# Altium schematic sheet Capstone.SchDoc
size A; SheetNumber: 1; SheetTotal: 3; SPICEModelCacheSYHMEIGD: <root> / <DocumentId>SYHMEIGD</DocumentId> / </root>
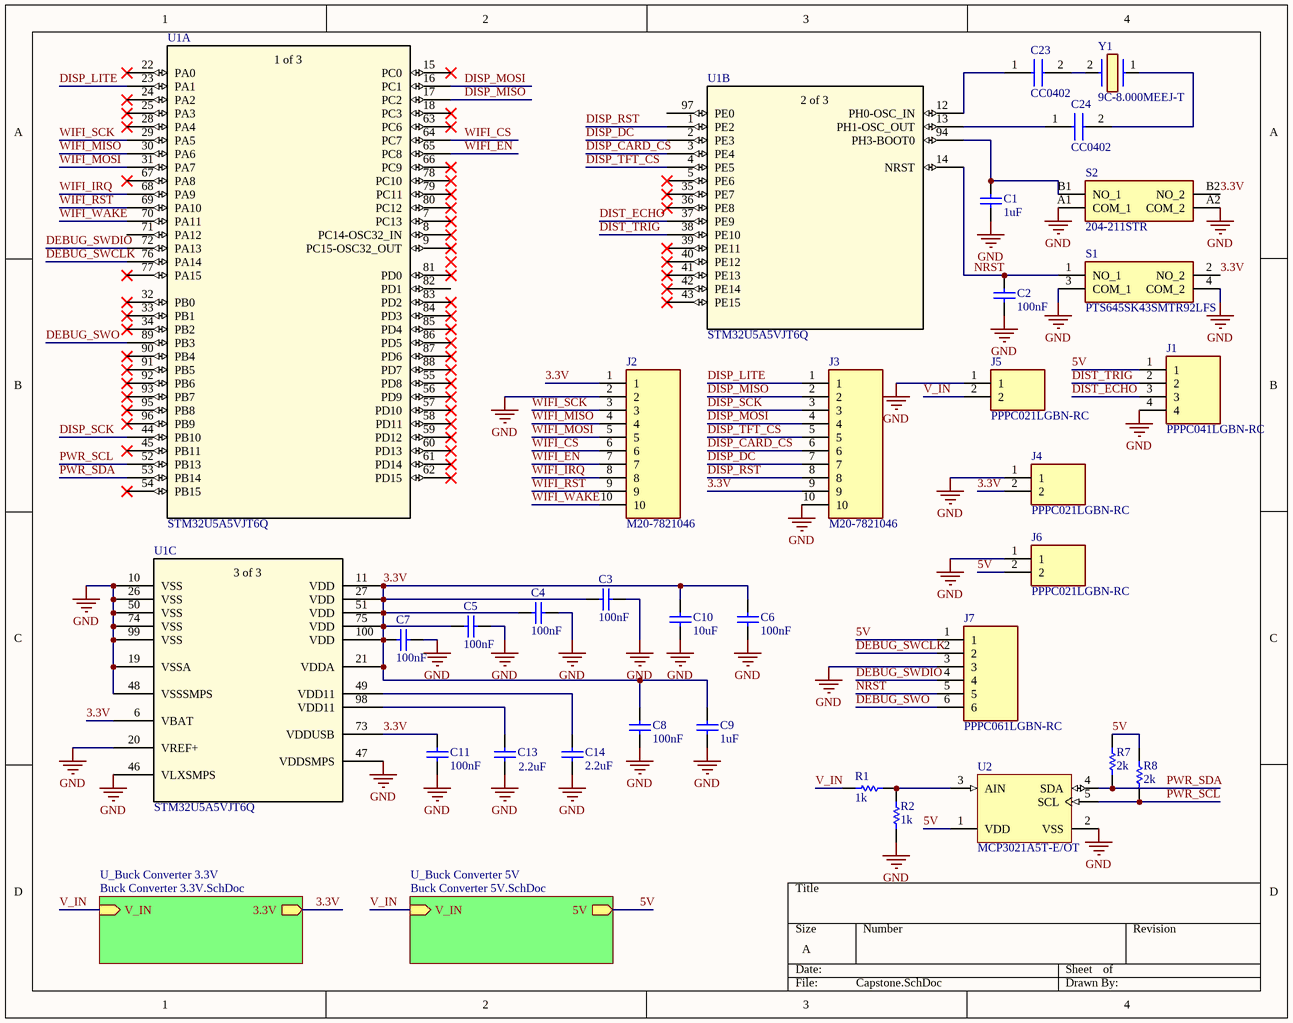
[diagram p0: Capstone.SchDoc]

## Parts
C1  1uF  [CAPC2013X135X45LL10T25]
C2  100nF  [CAPC2013X135X45LL10T25]
C3  100nF  [CAPC2013X135X45LL10T25]
C4  100nF  [CAPC2013X135X45LL10T25]
C5  100nF  [CAPC2013X135X45LL10T25]
C6  100nF  [CAPC2013X135X45LL10T25]
C7  100nF  [CAPC2013X135X45LL10T25]
C8  100nF  [CAPC2013X135X45LL10T25]
C9  1uF  [CAPC2013X135X45LL10T25]
C10  10uF  [CAPC2013X135X45LL10T25]
C11  100nF  [CAPC2013X135X45LL10T25]
C13  2.2uF  [CAPC2013X135X45LL10T25]
C14  2.2uF  [CAPC2013X135X45LL10T25]
C23  CC0402  [CAPC1005X55N]
C24  CC0402  [CAPC1005X55N]
J1  PPPC041LGBN-RC  [RHDRRA4W60P0X254_1X4_1066X850X274P]
J2  M20-7821046  [RHDR10W70P0X254_1X10_2580X250X865P]
J3  M20-7821046  [RHDR10W70P0X254_1X10_2580X250X865P]
J4  PPPC021LGBN-RC  [RHDRRA2W60P0X254_1X2_558X850X274P]
J5  PPPC021LGBN-RC  [RHDRRA2W60P0X254_1X2_558X850X274P]
J6  PPPC021LGBN-RC  [RHDRRA2W60P0X254_1X2_558X850X274P]
J7  PPPC061LGBN-RC  [PPPC061LGBNRC]
R1  1k  [RESC1608X55X25ML10T15]
R2  1k  [RESC1608X55X25ML10T15]
R7  2k  [RESC1608X55X25ML10T15]
R8  2k  [RESC1608X55X25ML10T15]
S1  PTS645SK43SMTR92LFS  [PTS645SK43SMTR92LFS]
S2  204-211STR  [204211STR]
U1  STM32U5A5VJT6Q  [LQFP-100_STM]  (parts A,B,C of 3)
U2  MCP3021A5T-E/OT  [SOT-23-OT5_M]
Y1  9C-8.000MEEJ-T  [9C7680MBBKT]

## Sub-sheets
U_Buck Converter 3.3V = Buck Converter 3.3V.SchDoc: 3.3V (out), V_IN (in)
U_Buck Converter 5V = Buck Converter 5V.SchDoc: 5V (out), V_IN (in)

## Nets
GND: C1.1 C2.1 C3.2 C4.2 C5.2 C6.1 C7.2 C8.1 C9.1 C10.1 C11.1 C13.1 C14.1 J1.4 J2.2 J3.10 J4.1 J5.1 J6.1 J7.3 R2.2 S1.3(COM_1) S1.4(COM_2) S2.A1(COM_1) S2.A2(COM_2) U1.10(VSS) U1.19(VSSA) U1.20(VREF+) U1.26(VSS) U1.46(VLXSMPS) U1.47(VDDSMPS) U1.48(VSSSMPS) U1.50(VSS) U1.74(VSS) U1.99(VSS) U2.2(VSS)
3.3V: C3.1 C4.1 C5.1 C6.2 C7.1 C8.2 C9.2 C10.2 C11.2 J2.1 J3.9 J4.2 S1.2(NO_2) S2.B2(NO_2) U1.6(VBAT) U1.11(VDD) U1.21(VDDA) U1.27(VDD) U1.51(VDD) U1.73(VDDUSB) U1.75(VDD) U1.100(VDD) ; sheet U_Buck Converter 3.3V/3.3V
5V: J1.1 J6.2 J7.1 R7.1 R8.1 U2.1(VDD) ; sheet U_Buck Converter 5V/5V
DEBUG_SWCLK: J7.2 U1.76(PA14)
DEBUG_SWDIO: J7.4 U1.72(PA13)
DEBUG_SWO: J7.6 U1.89(PB3)
DISP_CARD_CS: J3.6 U1.3(PE4)
DISP_DC: J3.7 U1.2(PE3)
DISP_LITE: J3.1 U1.23(PA1)
DISP_MISO: J3.2 U1.17(PC2)
DISP_MOSI: J3.4 U1.16(PC1)
DISP_RST: J3.8 U1.1(PE2)
DISP_SCK: J3.3 U1.44(PB10)
DISP_TFT_CS: J3.5 U1.4(PE5)
DIST_ECHO: J1.3 U1.37(PE9)
DIST_TRIG: J1.2 U1.38(PE10)
NRST: C2.2 J7.5 S1.1(NO_1) U1.14(NRST)
PWR_SCL: R8.2 U1.52(PB13) U2.5(SCL)
PWR_SDA: R7.2 U1.53(PB14) U2.4(SDA)
V_IN: J5.2 R1.2 ; sheet U_Buck Converter 3.3V/V_IN, sheet U_Buck Converter 5V/V_IN
WIFI_CS: J2.6 U1.64(PC7)
WIFI_EN: J2.7 U1.65(PC8)
WIFI_IRQ: J2.8 U1.68(PA9)
WIFI_MISO: J2.4 U1.30(PA6)
WIFI_MOSI: J2.5 U1.31(PA7)
WIFI_RST: J2.9 U1.69(PA10)
WIFI_SCK: J2.3 U1.29(PA5)
WIFI_WAKE: J2.10 U1.70(PA11)
NetC1_2: C1.2 S2.B1(NO_1) U1.94(PH3-BOOT0)
NetC13_2: C13.2 U1.98(VDD11)
NetC14_2: C14.2 U1.49(VDD11)
NetC23_1: C23.1 U1.12(PH0-OSC_IN)
NetC23_2: C23.2 Y1.2
NetC24_1: C24.1 U1.13(PH1-OSC_OUT)
NetC24_2: C24.2 Y1.1
NetR1_1: R1.1 R2.1 U2.3(AIN)

Not connected (* = marked no-connect by the designer): U1 5(PE6)* 7(PC13)* 8(PC14-OSC32_IN)* 9(PC15-OSC32_OUT)* 15(PC0)* 18(PC3)* 22(PA0)* 24(PA2)* 25(PA3)* 28(PA4)* 32(PB0)* 33(PB1)* 34(PB2)* 35(PE7)* 36(PE8)* 39(PE11)* 40(PE12)* 41(PE13)* 42(PE14)* 43(PE15)* 45(PB11)* 54(PB15)* 55(PD8)* 56(PD9)* 57(PD10)* 58(PD11)* 59(PD12)* 60(PD13)* 61(PD14)* 62(PD15)* 63(PC6)* 66(PC9)* 67(PA8)* 71(PA12) 77(PA15)* 78(PC10)* 79(PC11)* 80(PC12)* 81(PD0)* 82(PD1) 83(PD2)* 84(PD3)* 85(PD4)* 86(PD5)* 87(PD6)* 88(PD7)* 90(PB4)* 91(PB5)* 92(PB6)* 93(PB7)* 95(PB8)* 96(PB9)* 97(PE0)

## Notes on the sheet
- (in symbol STM32U5A5VJT6Q, part A) 1 of 3
- (in symbol STM32U5A5VJT6Q, part B) 2 of 3
- (in symbol STM32U5A5VJT6Q, part C) 3 of 3

## Library data of the parts
C1-C11 C13 C14 = CMP-1662-00015-2: Chip Capacitor, 4.7 uF, +/- 10%, 16 V, -55 to 85 degC, 0805 (2012 Metric), RoHS, Tape and Reel; PartNumber: GRM21BR61C475KA88L; Voltage Rating (DC): 16 V; Capacitance: 4.7 uF; Type (Capacitors): X5R; Case\/Package: 0805; Pins: 2; DatasheetVersion: 03/2016; REACH SVHC: No SVHC; Tolerance: 10%; Width: 1.25 mm; Mount: Surface Mount; ComponentLink1Description: Manufacturer URL; Case Code (Metric): 2012; PackageDescription: 2-Pin Surface Mount Device, Body 2 x 1.25 mm; Height: 1.25 mm; Voltage Rating: 16 V; Max Operating Temperature: 85 degC; RoHSCompliant: true; Length: 2 mm; ComponentLink1URL: http://www.murata.com/; Mounting Technology: Surface Mount; Packaging: Tape and Reel; Min Operating Temperature: -55 degC; ComponentLink2Description: Datasheet; Case Code (Imperial): 0805; Radiation Hardening: No; Package Quantity: 3000; PackageReference: 0805; ComponentLink2URL: http://search.murata.co.jp/Ceramy/image/img/A01X/G101/ENG/GRM21BR61C475KA88-01.pdf
C23 C24 = CC0402FRNPO9BN180: Capacitor; Manufacturer_Name: YAGEO; Datasheet Link: https://www.yageo.com/upload/media/product/productsearch/datasheet/mlcc/UPY-GP_NP0_16V-to-50V_18.pdf; Height: 0.55mm; Manufacturer_Part_Number: CC0402FRNPO9BN180
J1 = PPPC041LGBN-RC: Connector; Manufacturer_Name: Sullins; Datasheet Link: https://drawings-pdf.s3.amazonaws.com/10493.pdf; Height: 2.74mm; Manufacturer_Part_Number: PPPC041LGBN-RC
J2 J3 = M20-7821046: Connector; Manufacturer_Name: Harwin; Datasheet Link: https://cdn.harwin.com/pdfs/M20-782.pdf; Height: 8.65mm; Manufacturer_Part_Number: M20-7821046; Mouser Part Number: 855-M20-7821046; Mouser Price/Stock: https://www.mouser.co.uk/ProductDetail/Harwin/M20-7821046?qs=Jph8NoUxIfXTsFl0wvOA6g%3D%3D
J4-J6 = PPPC021LGBN-RC: Connector; Manufacturer_Name: Sullins; Datasheet Link: http://www.sullinscorp.com/drawings/78_P(N)PxCxx1LGBN-RC,_10493-G.pdf; Height: 2.74mm; Manufacturer_Part_Number: PPPC021LGBN-RC
J7 = PPPC061LGBN-RC: Connector; Manufacturer_Name: Sullins; Datasheet Link: https://drawings-pdf.s3.amazonaws.com/10493.pdf; Height: 2.74mm; Manufacturer_Part_Number: PPPC061LGBN-RC
R1 R2 R7 R8 = CMP-2100-03667-1: Chip Resistor, 0 Ohm, +/- 5%, 0.1 W, -55 to 155 degC, 0603 (1608 Metric), RoHS, Tape and Reel; Manufacturer: Yageo; Temperature Coefficient: 200ppm/degreesC; Voltage Rating: 50V; Power Rating: 100mW; Resistance: 0mOhm; Width: 0.8mm; Max Operating Temperature: 155degC; Tolerance: 5%; Package Reference: 0603; Height: 0.45mm; Depth: 0.8mm; Package Description: 2-Pin Surface Mount Device, Body 1.6 x 0.8 mm; Termination: SMD/SMT; Package Quantity: 5000; Case/Package: 0603; Case Code (Imperial): 0603; Radiation Hardening: No; Number of Pins: 2; Length: 1.6mm; Lead Free: LeadFree; Voltage Rating (DC): 50V; Military Standard: Not; Datasheet URL: http://www.yageo.com/NewPortal/yageodocoutput?fileName=/pdf/R-Chip/PYu-RC_Group_51_RoHS_L_5.pdf; Manufacturer URL: http://www.yageo.com/; Packaging: TapeandReel; Case Code (Metric): 1608; Min Operating Temperature: -55degC; Composition: ThickFilm; RoHSCompliant: true; Contact Plating: Tin; Datasheet Version: Rev. 5, 10/2016; REACH SVHC: NoSVHC
S1 = PTS645SK43SMTR92LFS: Switch; Manufacturer_Name: C & K COMPONENTS; Datasheet Link: https://www.ckswitches.com/media/1471/pts645.pdf; Height: 4.4mm; Manufacturer_Part_Number: PTS645SK43SMTR92LFS; Mouser Part Number: 611-PTS645SK43SMTR92; Mouser Price/Stock: https://www.mouser.co.uk/ProductDetail/CK/PTS645SK43SMTR92LFS?qs=UxeAxwACbqlWa%2Fy4o%252BzfBw%3D%3D; Arrow Part Number: PTS645SK43SMTR92LFS; Arrow Price/Stock: https://www.arrow.com/en/products/pts645sk43smtr92lfs/ck?region=nac
S2 = 204-211STR: Switch; Manufacturer_Name: CTS; Datasheet Link: https://www.ctscorp.com/wp-content/uploads/204.pdf; Height: 10.36mm; Manufacturer_Part_Number: 204-211STR; Mouser Part Number: 774-204-211STR; Mouser Price/Stock: https://www.mouser.co.uk/ProductDetail/CTS-Electronic-Components/204-211STR?qs=quytmY96oUgb3oIvtnAfmw%3D%3D; Arrow Part Number: 204-211STR; Arrow Price/Stock: https://www.arrow.com/en/products/204-211str/cts
U1 = STM32U5A5VJT6Q: No Description Available; Mfr_Name: STMicroelectronics; RefDes: RefDes; Type: Type
U2 = CMP-0188-00726-2: Low Power 10-Bit A/D Converter With I2C Interface, 5-Pin SOT-23, Extended Temperature, Tape and Reel; ComponentLink3Description: Package Specification; DatasheetVersion: revA, May-2003; RevisionNote: URLs added.; ComponentLink1URL: http://www.microchip.com/; ComponentLink2URL: http://ww1.microchip.com/downloads/en/DeviceDoc/21805a.pdf; ComponentLink3URL: http://www.microchip.com/stellent/groups/techpub_sg/documents/packagingspec/en012702.pdf; PackageReference: SOT-23-OT5; PackageVersion: revBB, Aug-2009; Code_IPC: SOT23-5; ComponentLink2Description: Datasheet; PackageDescription: 5-Lead Plastic Small Outline Transistor (OT) [SOT-23]; ComponentLink1Description: Manufacturer URL
Y1 = 9C-8.000MEEJ-T: Crystal or Oscillator; Manufacturer_Name: TXC CORPORATION; Datasheet Link: http://www.txccrystal.com/images/pdf/9c-accuracy.pdf; Height: 3.8mm; Manufacturer_Part_Number: 9C-8.000MEEJ-T; Mouser Part Number: 717-9C-8.000MEEJ-T; Mouser Price/Stock: https://www.mouser.co.uk/ProductDetail/TXC-Corporation/9C-8000MEEJ-T?qs=65dIHZNch5tI7l8164Zoqw%3D%3D; Arrow Part Number: 9C-8.000MEEJ-T; Arrow Price/Stock: https://www.arrow.com/en/products/9c-8.000meej-t/txc-corporation?region=nac